# EAGLE design LPC_2TE (EAGLE 5.01)
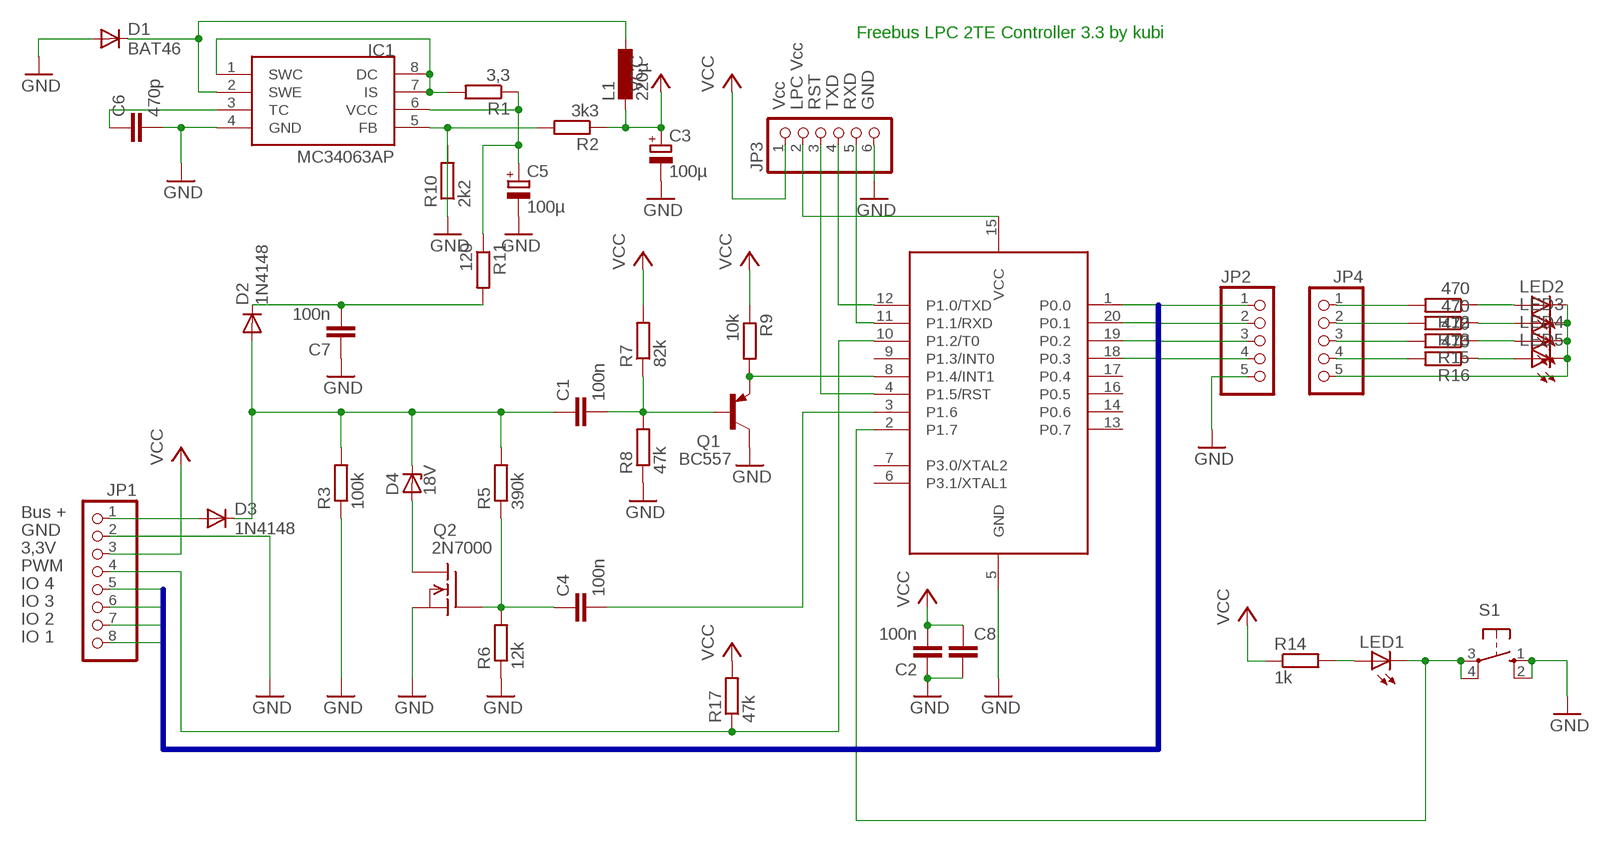
[diagram p0: schematic, sheet 1]

## Parts
C1  100n  C-EU050-024X044  [C050-024X044]
C2  100n  C-EU050-024X044  [C050-024X044]
C3  100µ  CPOL-EUE3.5-8  [E3,5-8]
C4  100n  C-EU050-024X044  [C050-024X044]
C5  100µ  CPOL-EUE3.5-8  [E3,5-8]
C6  470p  C-EU025-024X044  [C025-024X044]
C7  100n  C-EU050-024X044  [C050-024X044]
C8  C-EUC1206  [C1206]
D1  BAT46  BAT81  [DO34-7]
D2  1N4148  [DO35-10]
D3  1N4148  [DO35-10]
D4  18V  BZX85ZDIOV  [ZDIO-2.5]
IC1  MC34063AP  [DIL08]
JP1  PINHD-1X8  [1X08]
JP2  PINHD-1X5  [1X05]
JP3  PINHD-1X6  [1X06]
JP4  PINHD-1X5  [1X05]
L1  220µ  L-EU0207/2V  [0207/2V]
LED1  LED3MM  [LED3MM]
LED2  LED3MM  [LED3MM]
LED3  LED3MM  [LED3MM]
LED4  LED3MM  [LED3MM]
LED5  LED3MM  [LED3MM]
Q1  BC557  [TO92]
Q2  2N7000  VN2222KM  [TO237]
R1  3,3  R-EU_0207/2V  [0207/2V@1]
R2  3k3  R-EU_0207/2V  [0207/2V@1]
R3  100k  R-EU_0207/2V  [0207/2V@1]
R5  390k  R-EU_0207/2V  [0207/2V@1]
R6  12k  R-EU_0207/2V  [0207/2V@1]
R7  82k  R-EU_0207/2V  [0207/2V@1]
R8  47k  R-EU_0207/2V  [0207/2V@1]
R9  10k  R-EU_0207/2V  [0207/2V@1]
R10  2k2  R-EU_0207/2V  [0207/2V@1]
R11  120  R-EU_0207/2V  [0207/2V@1]
R12  470  R-EU_0207/10  [0207/10@1]
R13  470  R-EU_0207/10  [0207/10@1]
R14  1k  R-EU_0207/2V  [0207/2V@1]
R15  470  R-EU_0207/10  [0207/10@1]
R16  470  R-EU_0207/10  [0207/10@1]
R17  47k  R-EU_0207/2V  [0207/2V@1]
S1  10-XX  [B3F-10XX]
U1  89LPC922  [DIL20]

## Nets
GND: C2.1 C3.- C5.- C6.2 C7.1 C8.2 D1.A IC1.4(GND) JP1.2 JP2.5 JP3.6 Q1.3(C) Q2.3(S) R3.1 R6.1 R8.1 R10.2 S1.1(S) S1.2(S1) U1.5(GND)
N$1: Q1.1(E) R9.2 U1.8(P1.4/INT1)
N$2: C1.2 Q1.2(B) R7.1 R8.2
N$3: JP1.4 R17.1 U1.10(P1.2/T0)
N$4: C1.1 D2.A D3.C D4.C R3.2 R5.2
N$5: C4.2 U1.3(P1.6)
N$6: D4.A Q2.1(D)
N$7: LED1.K(C) S1.3(P) S1.4(P1) U1.2(P1.7)
N$8: IC1.1(SWC) IC1.7(IS) IC1.8(DC) R1.2
N$9: LED1.A R14.2
N$10: C5.+ IC1.6(VCC) R1.1 R11.1
N$11: IC1.5(FB) R2.2 R10.1
N$12: D1.C IC1.2(SWE) L1.1
N$13: C7.2 D2.C R11.2
N$14: C6.1 IC1.3(TC)
N$15: D3.A JP1.1
N$16: JP4.1 R12.2
N$17: JP4.2 R13.2
N$18: JP4.3 R15.2
N$19: JP4.4 R16.2
N$20: LED2.A R12.1
N$21: LED3.A R13.1
N$22: LED4.A R15.1
N$23: LED5.A R16.1
N$24: JP4.5 LED2.K(C) LED3.K(C) LED4.K(C) LED5.K(C)
N$29: JP3.4 U1.12(P1.0/TXD)
N$30: JP3.5 U1.11(P1.1/RXD)
N$31: JP3.3 U1.4(P1.5/RST)
N$32: JP3.2 U1.15(VCC)
N$34: C4.1 Q2.2(G) R5.1 R6.2
P0.0: JP1.8 JP2.1 U1.1(P0.0)
P0.1: JP1.7 JP2.2 U1.20(P0.1)
P0.2: JP1.6 JP2.3 U1.19(P0.2)
P0.3: JP1.5 JP2.4 U1.18(P0.3)
VCC: C2.2 C3.+ C8.1 JP1.3 JP3.1 L1.2 R2.1 R7.2 R9.1 R14.1 R17.2
Unconnected: U1.6(P3.1/XTAL1) U1.7(P3.0/XTAL2) U1.9(P1.3/INT0) U1.13(P0.7) U1.14(P0.6) U1.16(P0.5) U1.17(P0.4)

## Buses
P0.[0..3]

## Notes on the sheet
- Freebus LPC 2TE Controller 3.3 by kubi
- Vcc | LPC Vcc | RST | TXD | RXD | GND
- Bus +
- GND
- 3,3V
- PWM
- IO 4
- IO 3
- IO 2
- IO 1

## Library data of the parts
C1 C2 C4 C6-C8 = rcl:C-EU: CAPACITOR, European symbol
C3 C5 = rcl:CPOL-EU: POLARIZED CAPACITOR, European symbol
D1 = diode:BAT81: DIODE barrier diode
D2 D3 = diode:1N4148: DIODE high speed (Philips)
D4 = diode:BZX85: Z DIODE
IC1 = mc34063:MC34063
JP1 = pinhead:PINHD-1X8: PIN HEADER
JP2 JP4 = pinhead:PINHD-1X5: PIN HEADER
JP3 = pinhead:PINHD-1X6: PIN HEADER
L1 = rcl:L-EU: INDUCTOR, European symbol
LED1-LED5 = led:LED: LED OSRAM: - CHIPLED LG R971, LG N971, LY N971, LG Q971, LY Q971, LO R971, LY R971 LH N974, LH R974 LS Q976, LO Q976, LY Q976 LO Q996 - Hyper CHIPLED LW Q18S LB Q993, LB Q99A, LB R99A - SideLED LS A670, LO A670, LY A670, LG A670, LP A670 LB A673, LV A673, LT A673, LW A673 LH A674 LY A675 LS A676, LA A676, LO A676, LY A676, LW A676 LS A679, LY A679, LG A679 - Hyper Micro SIDELED® LS Y876, LA Y876, LO Y876, LY Y876 LT Y87S - SmartLED LW L88C, LW L88S LB L89C, LB L89S, LG L890 LS L89K, LO L89K, LY L89K LS L896, LA L896, LO L896, LY L896 - TOPLED LS T670, LO T670, LY T670, LG T670, LP T670 LSG T670, LSP T670, LSY T670, LOP T670, LYG T670 LG T671, LOG T671, LSG T671 LB T673, LV T673, LT T673, LW T673 LH T674 LS T676, LA T676, LO T676, LY T676, LB T676, LH T676, LSB T676, LW T676 LB T67C, LV T67C, LT T67C, LS T67K, LO T67K, LY T67K, LW E67C LS E67B, LA E67B, LO E67B, LY E67B, LB E67C, LV E67C, LT E67C LW T67C LS T679, LY T679, LG T679 LS T770, LO T770, LY T770, LG T770, LP T770 LB T773, LV T773, LT T773, LW T773 LH T774 LS E675, LA E675, LY E675, LS T675 LS T776, LA T776, LO T776, LY T776, LB T776 LHGB T686 LT T68C, LB T68C - Hyper Mini TOPLED® LB M676 - Mini TOPLED Santana® LG M470 LS M47K, LO M47K, LY M47K Source: http://www.osram.convergy.de - LUMILED® LXK2-PW12-R00, LXK2-PW12-S00, LXK2-PW14-U00, LXK2-PW14-V00 LXK2-PM12-R00, LXK2-PM12-S00, LXK2-PM14-U00 LXK2-PE12-Q00, LXK2-PE12-R00, LXK2-PE12-S00, LXK2-PE14-T00, LXK2-PE14-U00 LXK2-PB12-K00, LXK2-PB12-L00, LXK2-PB12-M00, LXK2-PB14-N00, LXK2-PB14-P00, LXK2-PB14-Q00 LXK2-PR12-L00, LXK2-PR12-M00, LXK2-PR14-Q00, LXK2-PR14-R00 LXK2-PD12-Q00, LXK2-PD12-R00, LXK2-PD12-S00 LXK2-PH12-R00, LXK2-PH12-S00 LXK2-PL12-P00, LXK2-PL12-Q00, LXK2-PL12-R00 Source: www.luxeon.com
Q1 = transistor-pnp:BC557: PNP Transistor
Q2 = transistor-fet:VN2222KM: N-Channel Enhancement MOSFET (VMOS); 60V; 0,5A; 7,5Ohm
R1-R3 R5-R17 = rcl:R-EU_: RESISTOR, European symbol
S1 = switch-omron:10-XX: OMRON SWITCH
U1 = micro-philips:89LPC922

## Board
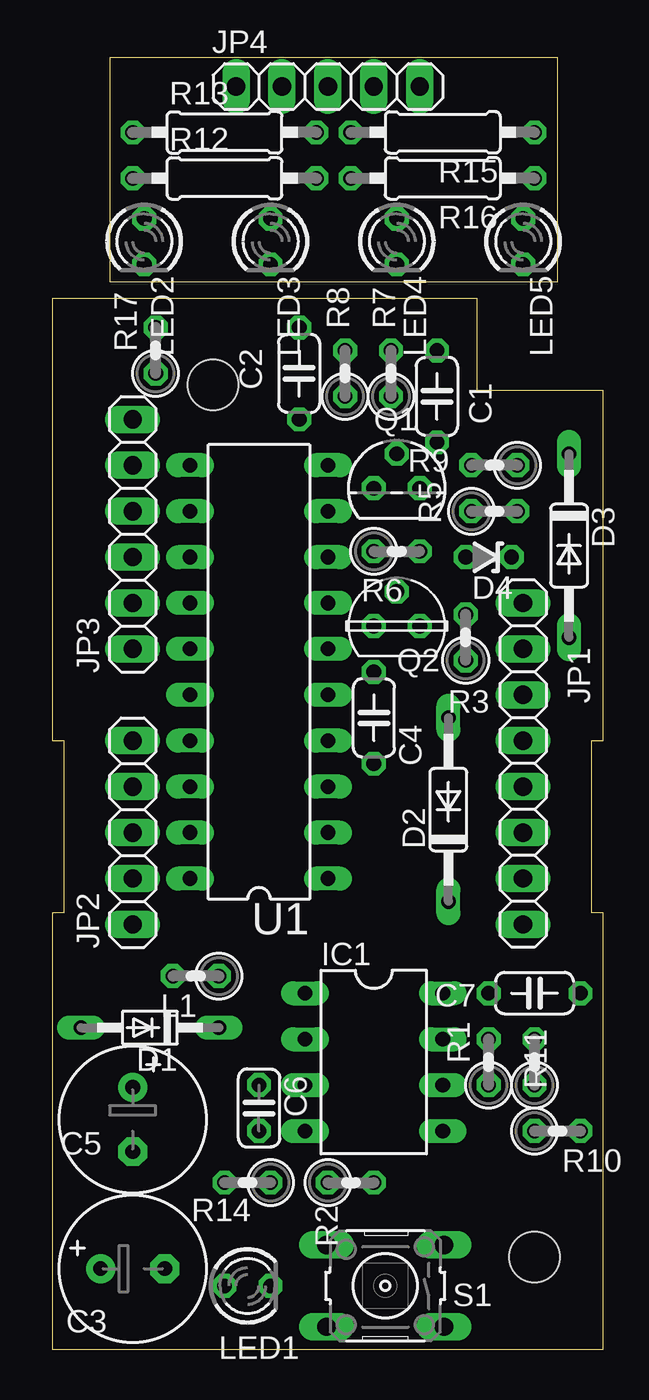
[diagram p1: board, top side]
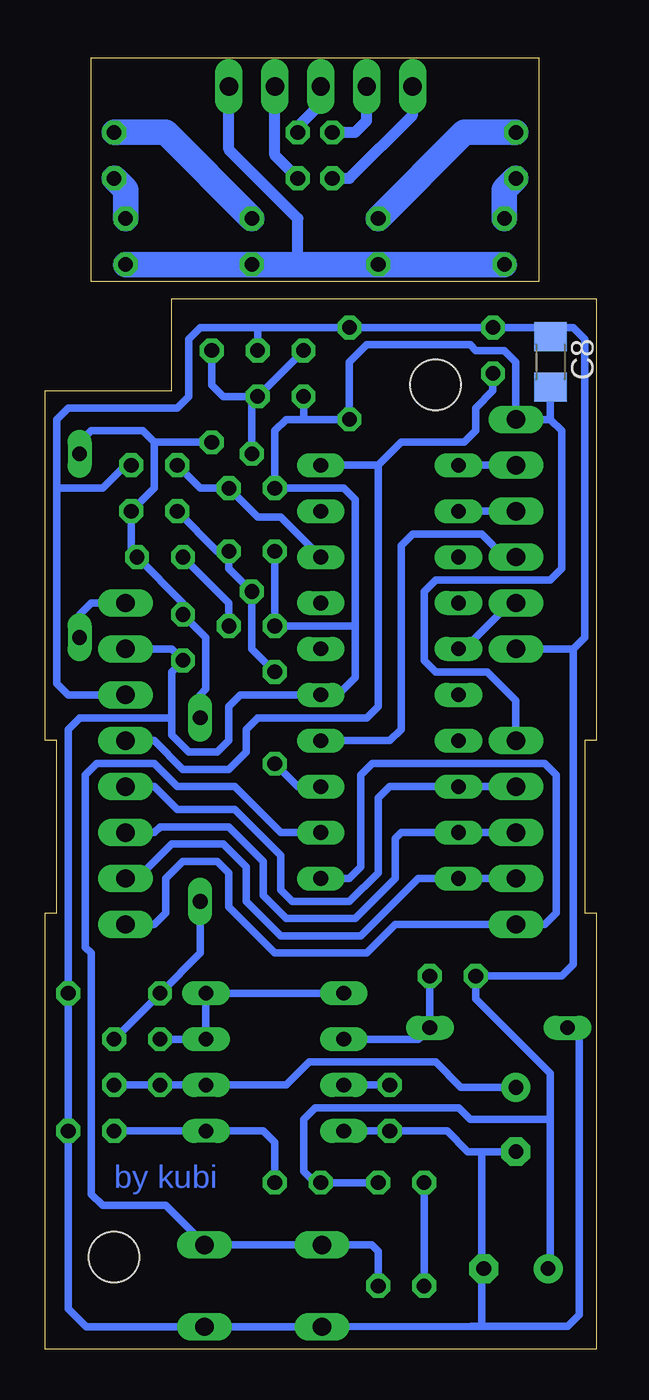
[diagram p2: board, bottom side, seen from below]

Size 30.48 x 71.44 mm. Coordinates in mm from the lower left corner, seen from the top.
Outline: 0,0 30.48,0 30.48,24.13 29.84,24.13 29.84,33.66 30.48,33.66 30.48,53.02 23.5,53.02 23.5,58.1 0,58.1 0,33.66 0.64,33.66 0.64,24.13 0,24.13 0,0
Outline: 3.17,59.05 27.94,59.05 27.94,71.44 3.17,71.44 3.17,59.05
Copper layers (1*16): Top 0.035mm / dielectric 1.5mm / Bottom 0.035mm
Design rules "default *": minimum track width 10mil, minimum drill 24mil, track to track 12mil, track to pad 12mil, pad to pad 12mil, via to via 16mil, smd to smd 8mil, copper to edge 20mil, drill to drill 8mil, minimum pad ring 10mil, minimum via ring 8mil, stop-mask expansion 4mil, vias tented up to drill 0mil, thermal gap 10mil
Holes 2.8 mm at 26.67,5.08 8.89,53.34

### Footprints (pad centres in the part's own frame; a part is rotated, then mirrored left to right if it is on the bottom)
C050-024X044 = drill 0.813 octagon: 1 -2.54,0; 2 2.54,0
E3,5-8 = drill 0.813 pad 1.6 round: + -1.778,0 | drill 0.813 pad 1.6 octagon: - 1.778,0
C025-024X044 = drill 0.813 octagon: 1 -1.27,0; 2 1.27,0
C1206 = smd 1.6 x 1.8: 1 -1.4,0; 2 1.4,0
DO34-7 = drill 0.813 long: A 3.81,0; C -3.81,0
DO35-10 = drill 0.813 long: A 5.08,0; C -5.08,0
ZDIO-2.5 = drill 0.813 octagon: A 1.27,0; C -1.27,0
DIL08 = drill 0.813 long: 1 -3.81,-3.81; 2 -1.27,-3.81; 3 1.27,-3.81; 4 3.81,-3.81; 5 3.81,3.81; 6 1.27,3.81; 7 -1.27,3.81; 8 -3.81,3.81
1X08 = drill 1.016 long: 1 -8.89,0; 2 -6.35,0; 3 -3.81,0; 4 -1.27,0; 5 1.27,0; 6 3.81,0; 7 6.35,0; 8 8.89,0
1X05 = drill 1.016 long: 1 -5.08,0; 2 -2.54,0; 3 0,0; 4 2.54,0; 5 5.08,0
1X06 = drill 1.016 long: 1 -6.35,0; 2 -3.81,0; 3 -1.27,0; 4 1.27,0; 5 3.81,0; 6 6.35,0
0207/2V = drill 0.813 octagon: 1 -1.27,0; 2 1.27,0
LED3MM = drill 0.813 octagon: A -1.27,0; K 1.27,0
TO92 = drill 0.813 octagon: 1 1.27,0; 2 0,1.905; 3 -1.27,0
TO237 = drill 0.813 octagon: 1 1.27,0; 2 0,1.905; 3 -1.27,0
0207/2V@1 = drill 0.813 octagon: 1 -1.27,0; 2 1.27,0
0207/10@1 = drill 0.813 octagon: 1 -5.08,0; 2 5.08,0
B3F-10XX = drill 1.016 long: 1 -3.251,2.261; 2 3.251,2.261; 3 -3.251,-2.261; 4 3.251,-2.261
DIL20 = drill 0.813 long: 1 -11.43,-3.81; 2 -8.89,-3.81; 3 -6.35,-3.81; 4 -3.81,-3.81; 5 -1.27,-3.81; 6 1.27,-3.81; 7 3.81,-3.81; 8 6.35,-3.81; 9 8.89,-3.81; 10 11.43,-3.81; 11 11.43,3.81; 12 8.89,3.81; 13 6.35,3.81; 14 3.81,3.81; 15 1.27,3.81; 16 -1.27,3.81; 17 -3.81,3.81; 18 -6.35,3.81; 19 -8.89,3.81; 20 -11.43,3.81

### Placement (x,y rotation side)
C1  21.27,52.7 90 top
C2  13.65,53.98 90 top
C3  4.45,4.45 0 top
C4  17.78,34.92 270 top
C5  4.45,12.7 270 top
C6  11.43,13.34 270 top
C7  26.67,19.68 180 top
C8  2.54,54.61 270 bottom
D1  5.4,17.78 180 top
D2  21.91,29.84 90 top
D3  28.57,44.45 270 top
D4  24.13,43.81 180 top
IC1  17.78,15.88 270 top
JP1  26.04,32.38 270 top
JP2  4.45,28.57 90 top
JP3  4.45,45.09 90 top
JP4  15.24,69.85 0 top
L1  7.94,20.64 180 top
LED1  10.79,3.49 0 top
LED2  5.08,61.28 270 top
LED3  12.06,61.28 270 top
LED4  19.05,61.28 270 top
LED5  26.04,61.28 270 top
Q1  19.05,47.62 0 top
Q2  19.05,40.01 0 top
R1  24.13,15.88 90 top
R2  16.51,9.21 0 top
R3  22.86,39.37 90 top
R5  24.45,46.35 0 top
R6  19.05,44.13 0 top
R7  18.73,53.98 90 top
R8  16.19,53.98 90 top
R9  24.45,48.9 180 top
R10  27.94,12.06 0 top
R11  26.67,15.88 90 top
R12  9.53,64.77 0 top
R13  9.53,67.31 0 top
R14  10.79,9.21 180 top
R15  21.59,67.31 180 top
R16  21.59,64.77 180 top
R17  5.71,55.24 90 top
S1  18.41,3.49 180 top
U1  11.43,37.47 90 top

### Tracks (layer width: path | path; a pad name or v marks a point on that pad's centre or on a via)
GND
  Bottom 0.406: 13.34,40.01 Q2.3 R6.1 | 13.34,40.01 13.34,46.99 13.97,47.62 Q1.3 17.78,50.8 17.14,51.44 16.19,51.44 | 16.19,51.44 R8.1 | 23.5,34.92 23.5,33.97 22.54,33.02 20.95,33.02 20.32,33.66 20.32,35.56 19.68,36.2 U1.5 14.29,36.2 13.34,37.15 13.34,40.01 | 23.5,34.92 23.5,37.47 R3.1 23.5,38.73 JP1.2 | 23.5,34.92 28.57,34.92 29.21,34.29 C7.1 R10.2 29.21,2.22 28.22,1.23 S1.1 15.28,1.23 15.24,1.27 15.16,1.19 S1.2 6.91,1.27 6.35,1.27 | JP2.5 4.45,35.88 6.03,37.47 8.89,37.47 9.53,38.1 9.53,41.91 8.89,42.55 2.54,42.55 1.91,43.18 1.91,50.8 2.54,51.44 | 2.54,51.44 JP3.6 4.45,54.61 5.08,55.24 6.67,55.24 6.99,55.56 12.7,55.56 13.65,54.61 C2.1 16.19,51.44 | IC1.4 C6.2 8.26,12.06 7.11,10.92 6.35,10.92 | 6.35,10.92 C5.- | D1.A 0.95,17.14 0.95,1.91 1.59,1.27 6.35,1.27 | 6.35,10.92 6.35,4.57 arc-90 C3.- 6.35,4.45 6.35,1.27 | C8.2 2.54,51.44
N$1
  Bottom 0.406: U1.8 17.46,46.04 18.73,46.04 Q1.1 21.91,47.62 R9.2
N$2
  Bottom 0.406: R8.2 R7.1 19.05,52.7 | C1.2 21.27,53.34 20.64,52.7 19.05,52.7 | Q1.2 19.05,52.7
N$3
  Bottom 0.406: 12.06,48.9 12.06,35.56 12.7,34.92 18.73,34.92 19.37,34.29 19.37,33.02 20.32,32.07 22.86,32.07 24.45,33.66 JP1.4 | 12.06,48.9 U1.10 | 12.06,48.9 10.79,50.16 7.3,50.16 6.67,50.8 6.67,52.07 5.71,53.02 R17.1
N$4
  Bottom 0.406: 24.45,50.16 25.08,50.8 27.94,50.8 28.57,50.16 D3.C | D2.A 21.91,36.2 21.59,36.51 21.59,39.37 R3.2 22.86,41.27 D4.C 25.72,44.13 R5.2 24.45,47.62 24.45,50.16 | C1.1 24.45,50.16
N$5
  Bottom 0.406: C4.2 16.51,31.11 U1.3
N$6
  Bottom 0.406: Q2.1 20.32,41.27 D4.A
N$7
  Bottom 0.406: LED1.K 12.06,5.4 12.42,5.75 S1.4 15.16,5.96 15.24,6.03 15.52,5.75 S1.3 21.63,5.75 | U1.2 17.46,28.57 20,31.11 23.18,31.11 24.45,32.38 27.62,32.38 28.26,31.75 28.26,22.23 27.94,21.91 27.94,8.57 27.3,7.94 23.81,7.94 21.63,5.75 | 21.63,5.75 21.59,5.71
N$8
  Bottom 0.406: IC1.1 IC1.8 IC1.7 R1.2
N$9
  Bottom 0.406: LED1.A R14.2
N$10
  Bottom 0.406: C5.+ 7.49,14.48 8.89,15.88 15.88,15.88 17.14,14.61 IC1.6 R1.1 R11.1
N$11
  Bottom 0.406: R2.2 17.78,11.43 18.41,12.06 IC1.5 R10.1
N$12
  Bottom 0.406: IC1.2 9.84,17.14 D1.C L1.1
N$13
  Bottom 0.406: D2.C 21.91,21.91 C7.2 R11.2
N$14
  Bottom 0.406: C6.1 IC1.3
N$15
  Bottom 0.406: D3.A 28.57,40.64 27.94,41.27 JP1.1
N$16
  Bottom 0.61: JP4.1 10.16,68.26 13.65,64.77 R12.2
N$17
  Bottom 0.61: JP4.2 12.7,67.94 13.34,67.31 R13.2
N$18
  Bottom 0.61: R15.2 16.51,67.63 15.24,68.9 JP4.3
N$19
  Bottom 0.61: JP4.4 17.78,66.04 R16.2
N$20
  Bottom 1.422: R12.1 5.08,64.14 LED2.A
N$21
  Bottom 1.422: R13.1 7.3,67.31 LED3.A
N$22
  Bottom 1.422: LED4.A 23.81,67.31 R15.1
N$23
  Bottom 1.422: LED5.A 26.04,64.14 R16.1
N$24
  Bottom 0.61: JP4.5 20.32,66.36 16.51,62.55 16.51,60.01
  Bottom 1.422: LED2.K LED3.K 16.51,60.01 LED4.K LED5.K
N$29
  Bottom 0.406: JP3.4 U1.12
N$30
  Bottom 0.406: JP3.5 U1.11
N$31
  Bottom 0.406: U1.4 11.43,33.66 10.79,34.29 10.79,44.45 10.16,45.09 6.35,45.09 5.08,43.81 JP3.3
N$32
  Bottom 0.406: JP3.2 4.76,41.27 7.3,38.73 U1.15
N$34
  Bottom 0.406: R5.1 20.95,44.13 R6.2 20.32,43.18 Q2.2 19.05,38.73 C4.1
P0.0
  Bottom 0.406: U1.1 13.65,26.04 13.02,26.67 13.02,31.75 12.38,32.38 2.86,32.38 2.22,31.75 2.22,24.13 2.86,23.5 JP2.1 11.11,23.5 12.7,21.91 17.78,21.91 20.32,24.45 20.32,26.35 20.95,26.99 22.86,26.99 23.81,26.04 23.81,24.13 24.45,23.5 JP1.8
P0.1
  Bottom 0.406: JP2.2 U1.20 9.84,26.04 13.02,22.86 17.46,22.86 19.37,24.77 19.37,26.67 20.64,27.94 23.5,27.94 25.4,26.04 JP1.7
P0.2
  Bottom 0.406: JP2.3 U1.19 10.79,28.57 11.11,28.26 11.11,26.04 13.34,23.81 17.14,23.81 18.41,25.08 18.41,26.99 20.32,28.89 24.13,28.89 24.45,28.57 JP1.6
P0.3
  Bottom 0.406: JP2.4 U1.18 11.43,31.11 12.06,30.48 12.06,26.35 13.65,24.77 16.83,24.77 17.46,25.4 17.46,27.3 20,29.84 23.18,29.84 24.45,31.11 JP1.5
VCC
  Bottom 0.406: 1.27,38.73 0.64,39.37 0.64,55.88 1.27,56.52 2.54,56.52 | 1.27,38.73 JP3.1 | 29.84,47.62 29.84,51.44 29.21,52.07 23.18,52.07 22.54,52.7 22.54,55.88 21.91,56.52 18.73,56.52 | 29.84,47.62 29.84,36.83 29.21,36.2 JP1.3 | 29.84,47.62 27.3,47.62 26.04,48.9 R9.1 | 2.54,56.52 3.17,56.52 | 3.17,56.52 C2.2 18.73,56.52 | 1.27,38.73 1.27,21.27 1.91,20.64 L1.2 6.67,19.37 2.54,15.24 2.54,12.7 | R14.1 R2.1 15.56,9.21 16.19,9.84 16.19,12.7 15.56,13.34 7.62,13.34 6.99,12.7 2.54,12.7 | C3.+ 2.54,4.45 2.54,12.7 | 18.73,56.52 R7.2 | 3.17,56.52 R17.2 | 2.54,56.52 C8.1

### Text on the board
Bottom: by kubi